# Altium schematic sheet GAT562 Mesh Solar Relay V1.3.SchDoc
size A4
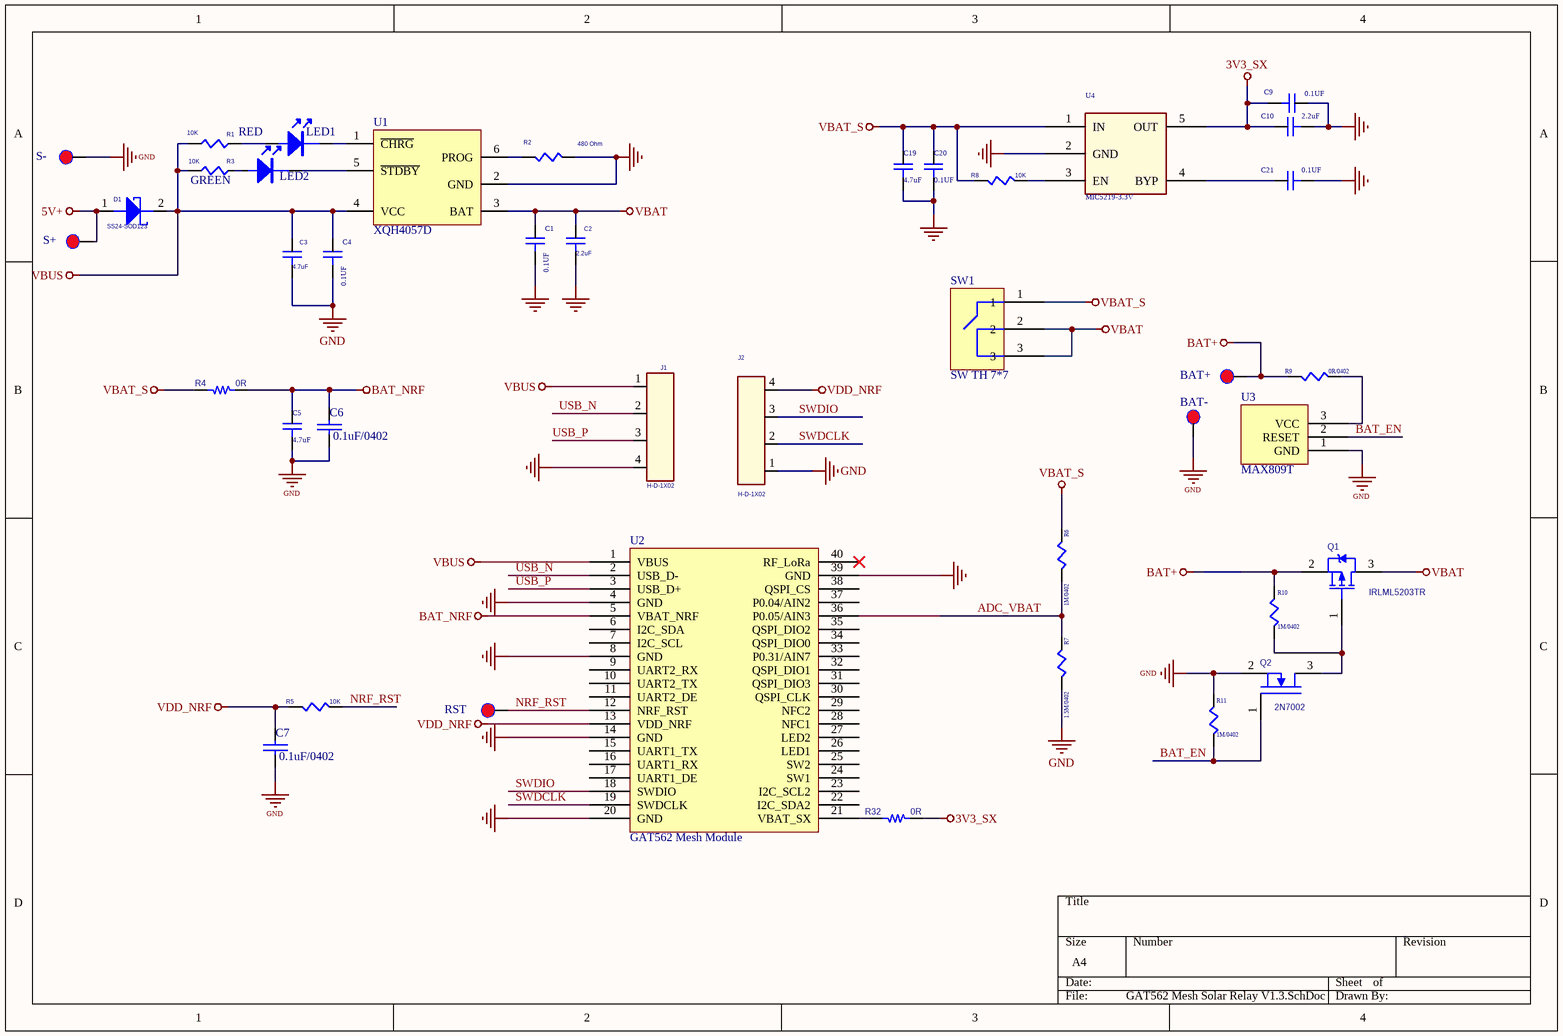
[diagram p0: GAT562 Mesh Solar Relay V1.3.SchDoc]

## Parts
BAT+  (no value)  [pad2*3]  (no BOM)
BAT-  (no value)  [pad2*3]  (no BOM)
C1  0.1UF  [C0402]
C2  2.2uF  [C0402]
C3  4.7uF  [C0402]
C4  0.1UF  [C0402]
C5  4.7uF  [C0402]
C6  0.1uF/0402  [C0402]
C7  0.1uF/0402  [C0402]
C9  0.1UF  [C0402]
C10  2.2uF  [C0402]
C19  4.7uF  [C0402]
C20  0.1UF  [C0402]
C21  0.1UF  [C0402]
D1  SS24-SOD123  [SOD-123-1]
J1  H-D-1X02  [HDR1X4-2.0]
J2  H-D-1X02  [HDR1X4-2.0]
LED1  RED  [LED0603_RED_3D]
LED2  GREEN  [LED0603_RED_3D]
Q1  IRLML5203TR  [SOT23]
Q2  2N7002  [SOT23]
R1  10K  [R0402]
R2  480 Ohm  [R0402]
R3  10K  [R0402]
R4  0R  [R0402]
R5  10K  [R0402]
R6  1M/0402  [R0402]
R7  1.5M/0402  [R0402]
R8  10K  [R0402]
R9  0R/0402  [R0402]
R10  1M/0402  [R0402]
R11  1M/0402  [R0402]
R32  0R  [R0402]
RST  (no value)  [PAD_29mil]  (no BOM)
S+  (no value)  [pad1*2]  (no BOM)
S-  (no value)  [pad1*2]  (no BOM)
SW1  SW TH 7*7  [SW TH 7*7]
U1  XQH4057D  [XQH4057D]
U2  GAT562 Mesh Module  [gat562 module]
U3  MAX809T  [SOT23]
U4  MIC5219-3.3V  [SOT23-5]

## Nets
3V3_SX: C9.2 C10.1 R32.2 U4.5(OUT)
5V+: D1.1(ANODE) S+.1
BAT+: BAT+.1 Q1.2(S) R9.2 R10.2
BAT_NRF: C5.1 C6.2 R4.2 U2.5(VBAT_NRF)
GND: BAT-.1 C1.2 C2.2 C3.2 C4.2 C5.2 C6.1 C7.1 C9.1 C10.2 C19.2 C20.2 C21.2 J1.4 J2.1 Q2.2(OUT) R2.2 R7.1 R11.2 S-.1 U1.2(GND) U2.4(GND) U2.8(GND) U2.14(GND) U2.20(GND) U2.39(GND) U3.1(GND) U4.2(GND)
VBAT: C1.1 C2.1 Q1.3(D) SW1.2 SW1.3 U1.3(BAT)
VBAT_S: C19.1 C20.1 R4.1 R6.2 R8.1 SW1.1 U4.1(IN)
VBUS: C3.1 C4.1 D1.2(CATHODE) J1.1 R1.2 R3.2 U1.4(VCC) U2.1(VBUS)
VDD_NRF: C7.2 J2.4 R5.1 U2.13(VDD_NRF)
ADC_VBAT: R6.1 R7.2 U2.36(P0.05/AIN3)
BAT_EN: Q2.1(IN) R11.1 U3.2(RESET)
NRF_RST: R5.2 RST.1 U2.12(NRF_RST)
SWDCLK: J2.2 U2.19(SWDCLK)
SWDIO: J2.3 U2.18(SWDIO)
USB_N: J1.2 U2.2(USB_D-)
USB_P: J1.3 U2.3(USB_D+)
NetC21_1: C21.1 U4.4(BYP)
NetLED1_1: LED1.1 R1.1
NetLED1_2: LED1.2 U1.1(~{CHRG})
NetLED2_1: LED2.1 R3.1
NetLED2_2: LED2.2 U1.5(~{STDBY})
NetQ1_1: Q1.1(G) Q2.3(GND) R10.1
NetR2_1: R2.1 U1.6(PROG)
NetR8_2: R8.2 U4.3(EN)
NetR9_1: R9.1 U3.3(VCC)
NetR32_1: R32.1 U2.21(VBAT_SX)

Not connected (* = marked no-connect by the designer): U2 6(I2C_SDA) 7(I2C_SCL) 9(UART2_RX) 10(UART2_TX) 11(UART2_DE) 15(UART1_TX) 16(UART1_RX) 17(UART1_DE) 22(I2C_SDA2) 23(I2C_SCL2) 24(SW1) 25(SW2) 26(LED1) 27(LED2) 28(NFC1) 29(NFC2) 30(QSPI_CLK) 31(QSPI_DIO3) 32(QSPI_DIO1) 33(P0.31/AIN7) 34(QSPI_DIO0) 35(QSPI_DIO2) 37(P0.04/AIN2) 38(QSPI_CS) 40(RF_LoRa)*

## Library data of the parts
BAT+ BAT- RST S+ S- = TEST-DOT
C1 C4 C5 C9 C10 C19-C21 = 0_1.1UF
C2 C3 = 0.1UF
C6 C7 = CAP: Capacitor
D1 = DIODE SCHOTTKY_0: DIODE 1N5817,DIP, 20V, 1A; Vendor PN: SBR3A40SA; Vendor: DIODES Incorporated.; Package: SMA
J1 J2 = CON6_1_Dup1
LED1 LED2 = LED
Q1 = PMOS-2: P-Channel Power MOSFET; Note: Pin 4 not drawn and electrically connected to Pin 2.; Published: 8-Jun-2000; LatestRevisionDate: 17-Jul-2002; LatestRevisionNote: Re-released for DXP Platform.; DatasheetVersion: PD-9.390D; PackageVersion: Feb-1997; PackageReference: TO-220AB; Publisher: Altium Limited; PackageDescription: TO, Thru-Hole, Vertical, Heatsink Mounted; 3 In-Line Leads; Pitch 2.54 mm; ComponentLink1Description: Manufacturer Link; ComponentLink1URL: http://www.irf.com/
Q2 = MOSFET-N
R1-R3 R5-R11 = R0402_1.06K_WALSIN: VENDER\PN: WALSIN\WR04X8061FT; NO_STUFF: .
R4 R32 = RES: Resistor , 2K Ohm 0402  5%
SW1 = SW TH 7*7: SW TH 7*7 3P/6P
U2 = INTERFACE
U3 = MAX809T: MAX809T SOT23
U4 = REG CAT7101_2